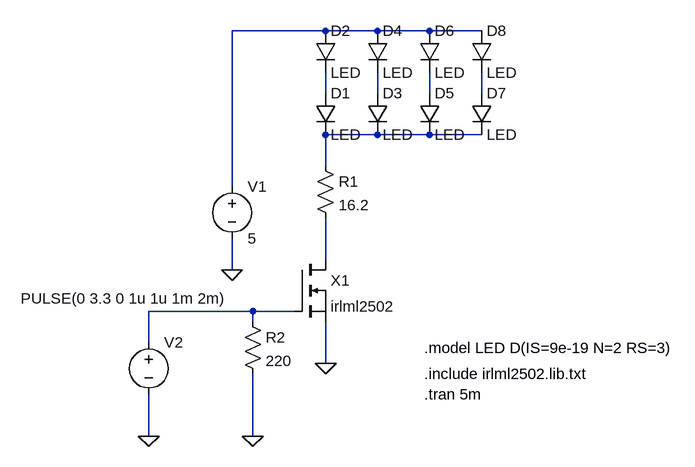
[diagram p0: schematic 196 Circuit Planning.asc]
196 Circuit Planning.asc, the LTspice schematic file:
Version 4
SHEET 1 952 680
WIRE 144 -272 0 -272
WIRE 224 -272 144 -272
WIRE 304 -272 224 -272
WIRE 384 -272 304 -272
WIRE 144 -176 144 -208
WIRE 224 -176 224 -208
WIRE 304 -176 304 -208
WIRE 384 -176 384 -208
WIRE 224 -112 144 -112
WIRE 304 -112 224 -112
WIRE 384 -112 304 -112
WIRE 144 -64 144 -112
WIRE 0 -32 0 -272
WIRE 144 80 144 16
WIRE 0 96 0 48
WIRE 32 160 -128 160
WIRE 96 160 32 160
WIRE 32 176 32 160
WIRE -128 208 -128 160
WIRE 144 240 144 176
WIRE -128 352 -128 288
WIRE 32 352 32 256
FLAG 0 96 0
FLAG 144 240 0
FLAG -128 352 0
FLAG 32 352 0
SYMBOL nmos 96 80 R0
SYMATTR InstName X1
SYMATTR Value irlml2502
SYMATTR Prefix X
SYMBOL voltage 0 -48 R0
SYMATTR InstName V1
SYMATTR Value 5
SYMBOL res 128 -80 R0
SYMATTR InstName R1
SYMATTR Value 16.2
SYMBOL voltage -128 192 R0
WINDOW 3 -197 -52 Left 2
WINDOW 123 0 0 Left 0
WINDOW 39 0 0 Left 0
SYMATTR Value PULSE(0 3.3 0 1u 1u 1m 2m)
SYMATTR InstName V2
SYMBOL diode 128 -176 R0
SYMATTR InstName D1
SYMATTR Value LED
SYMBOL diode 128 -272 R0
SYMATTR InstName D2
SYMATTR Value LED
SYMBOL res 16 160 R0
SYMATTR InstName R2
SYMATTR Value 220
SYMBOL diode 208 -176 R0
SYMATTR InstName D3
SYMATTR Value LED
SYMBOL diode 208 -272 R0
SYMATTR InstName D4
SYMATTR Value LED
SYMBOL diode 288 -176 R0
SYMATTR InstName D5
SYMATTR Value LED
SYMBOL diode 288 -272 R0
SYMATTR InstName D6
SYMATTR Value LED
SYMBOL diode 368 -176 R0
SYMATTR InstName D7
SYMATTR Value LED
SYMBOL diode 368 -272 R0
SYMATTR InstName D8
SYMATTR Value LED
TEXT 296 256 Left 2 !.include irlml2502.lib.txt
TEXT 296 288 Left 2 !.tran 5m
TEXT 296 216 Left 2 !.model LED D(IS=9e-19 N=2 RS=3)

The netlist it stands for:
* 196 Circuit Planning.asc
XX1 N007 N008 0 irlml2502  ; pins D G S
V1 N001 0 5
R1 N006 N007 16.2
V2 N008 0 PULSE(0 3.3 0 1u 1u 1m 2m)
D1 N002 N006 LED
D2 N001 N002 LED
R2 N008 0 220
D3 N003 N006 LED
D4 N001 N003 LED
D5 N004 N006 LED
D6 N001 N004 LED
D7 N005 N006 LED
D8 N001 N005 LED
.model D D
.lib standard.dio
.include irlml2502.lib.txt
.tran 5m
.model LED D(IS=9e-19 N=2 RS=3)
.backanno
.end